# Altium schematic sheet numeric.SchDoc: Balise Vision - Interfaces numériques
size A3; Author: B Labbe; CompanyName: Oufffteam; DrawnBy: B Labbe; Engineer: B Labbe; Organization: Oufffteam; Address1: L3, 12a Rodborough Rd; Address2: Frenchs Forest; Address3: NSW; Address4: Australia 2086; Revision: A; SheetNumber: 2; SheetTotal: 10; DocumentName: Balise Vision - Interfaces numériques
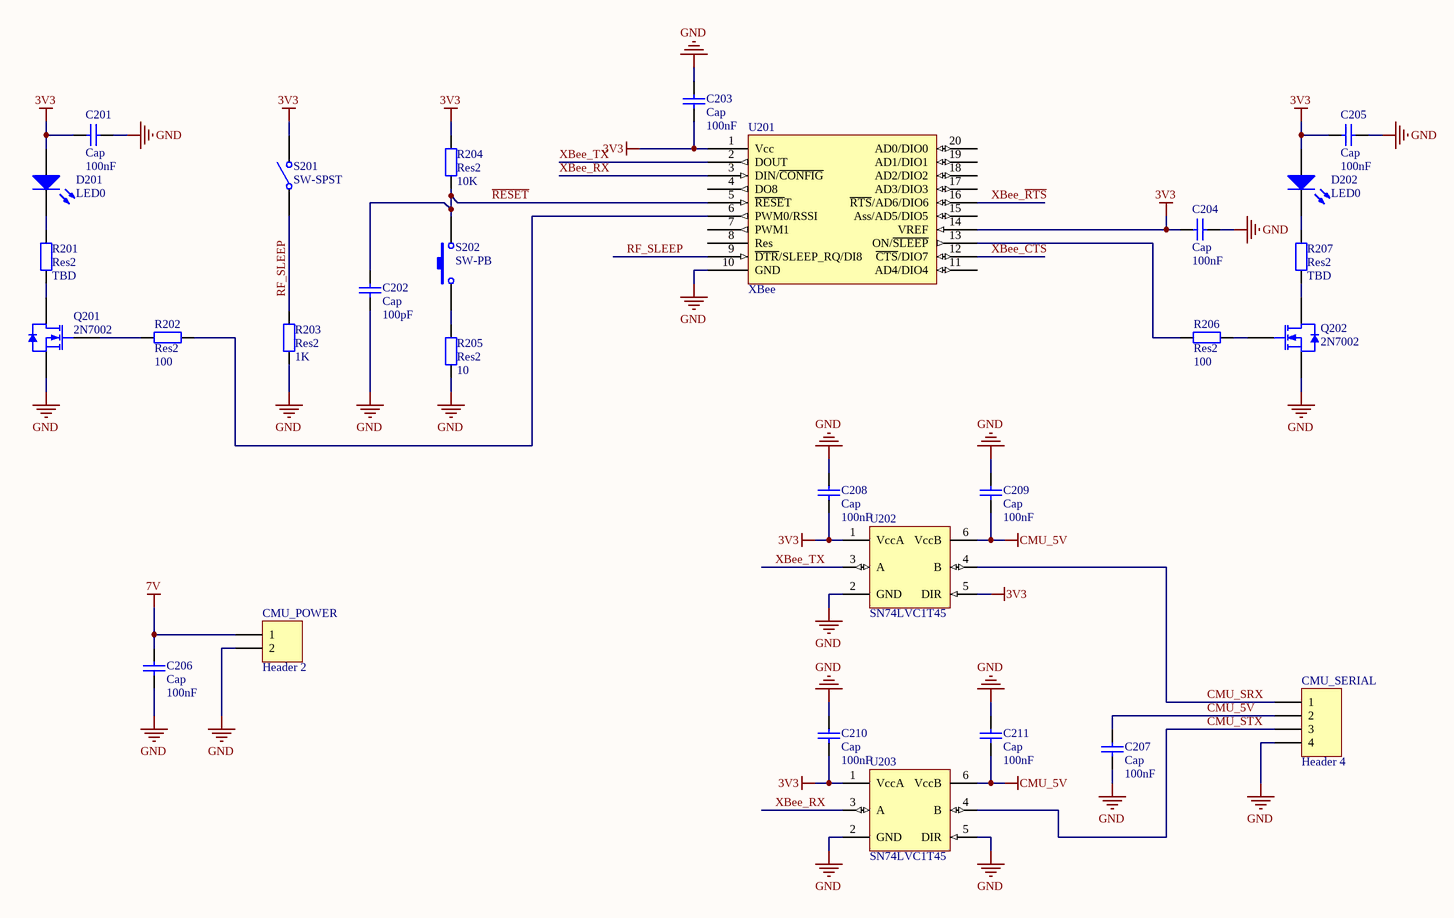
[diagram p0: numeric.SchDoc]

## Parts
C201  Cap  value 100nF  [RAD-0.3]
C202  Cap  value 100pF  [RAD-0.3]
C203  Cap  value 100nF  [RAD-0.3]
C204  Cap  value 100nF  [RAD-0.3]
C205  Cap  value 100nF  [RAD-0.3]
C206  Cap  value 100nF  [RAD-0.3]
C207  Cap  value 100nF  [RAD-0.3]
C208  Cap  value 100nF  [RAD-0.3]
C209  Cap  value 100nF  [RAD-0.3]
C210  Cap  value 100nF  [RAD-0.3]
C211  Cap  value 100nF  [RAD-0.3]
CMU_POWER  Header 2  [HDR1X2]
CMU_SERIAL  Header 4  [HDR1X4]
D201  LED0  [LED-0]
D202  LED0  [LED-0]
Q201  2N7002  [SOT23_N]
Q202  2N7002  [SOT23_N]
R201  Res2  value TBD  [AXIAL-0.4]
R202  Res2  value 100  [AXIAL-0.4]
R203  Res2  value 1K  [AXIAL-0.4]
R204  Res2  value 10K  [AXIAL-0.4]
R205  Res2  value 10  [AXIAL-0.4]
R206  Res2  value 100  [AXIAL-0.4]
R207  Res2  value TBD  [AXIAL-0.4]
S201  SW-SPST  [SPST-2]
S202  SW-PB  [SPST-2]
U201  XBee
U202  SN74LVC1T45  [1262-01]
U203  SN74LVC1T45  [1262-01]

## Nets
3V3: C201.1 C203.1 C204.2 C205.1 C208.1 C210.1 D201.1(A) D202.1(A) R204.2 S201.2(NO) U201.1(Vcc) U201.14(VREF) U202.1(VccA) U202.5(DIR) U203.1(VccA)
7V: C206.2 CMU_POWER.1
CMU_5V: C207.2 C209.1 C211.1 CMU_SERIAL.2 U202.6(VccB) U203.6(VccB)
GND: C201.2 C202.1 C203.2 C204.1 C205.2 C206.1 C207.1 C208.2 C209.2 C210.2 C211.2 CMU_POWER.2 CMU_SERIAL.4 Q201.2(S) Q202.2(S) R203.1 R205.1 U201.10(GND) U202.2(GND) U203.2(GND) U203.5(DIR)
CMU_SRX: CMU_SERIAL.1 U202.4(B)
CMU_STX: CMU_SERIAL.3 U203.4(B)
~{RESET}: C202.2 R204.1 S202.2 U201.5(~{RESE}T)
RF_SLEEP: R203.2 S201.1(COMMON) U201.9(~{DTR}/SLEEP_RQ/DI8)
XBee_~{CTS}: U201.12(~{CTS}/DIO7)
XBee_~{RTS}: U201.16(~{RTS}/AD6/DIO6)
XBee_RX: U201.3(DIN/~{CONFIG}) U203.3(A)
XBee_TX: U201.2(DOUT) U202.3(A)
NetD201_2: D201.2(K) R201.2
NetD202_2: D202.2(K) R207.2
NetQ201_1: Q201.1(G) R202.1
NetQ201_3: Q201.3(D) R201.1
NetQ202_1: Q202.1(G) R206.2
NetQ202_3: Q202.3(D) R207.1
NetR202_2: R202.2 U201.6(PWM0/RSSI)
NetR205_2: R205.2 S202.1
NetR206_1: R206.1 U201.13(ON/~{SLEEP})

Not connected (* = marked no-connect by the designer): U201 4(DO8) 7(PWM1) 8(Res) 11(AD4/DIO4) 15(Ass/AD5/DIO5) 17(AD3/DIO3) 18(AD2/DIO2) 19(AD1/DIO1) 20(AD0/DIO0)

## Notes on the sheet
- Title
- Size:
- Date:
- A3
- Number:
- Time:
- Revision:
- Sheet
- of
- Oufffteam
- 3 place Carnot
- 26100
- Romans sur Isère
- oufffteam@gmail.com
- File:

## Library data of the parts
C201-C211 = Cap: Capacitor; Published: 8-Jun-2000; LatestRevisionDate: 17-Jul-2002; LatestRevisionNote: Re-released for DXP Platform.; PackageReference: RAD-0.3; Publisher: Altium Limited
CMU_POWER = Header 2: Header, 2-Pin; LatestRevisionDate: 17-Jul-2002; LatestRevisionNote: Re-released for DXP Platform.; Publisher: Altium Limited
CMU_SERIAL = Header 4: Header, 4-Pin; LatestRevisionDate: 17-Jul-2002; LatestRevisionNote: Re-released for DXP Platform.; Publisher: Altium Limited
D201 D202 = LED0: Typical INFRARED GaAs LED; Published: 8-Jun-2000; LatestRevisionDate: 08-Jul-2005; LatestRevisionNote: Mech Layer 1 removed.; PackageReference: LED-0; Publisher: Altium Limited
Q201 Q202 = 2N7002: N-channel Enhancement Mode Field-effect Transistor; Published: 17-Sep-2003; LatestRevisionDate: 12-Dec-2006; LatestRevisionNote: IPC-7351 Footprint Added.; DatasheetVersion: 27-Jul-2000; PackageVersion: May-1999; PackageReference: SOT23; Publisher: Altium Limited; PackageDescription: 3-Pin SOT-23 Package 0.95 mm Pitch, 2.3 mm Lead Span; ComponentLink1Description: Manufacturer Link; ComponentLink1URL: http://www.semiconductors.philips.com/; ComponentLink2Description: Datasheet; ComponentLink2URL: http://www.semiconductors.philips.com/acrobat/datasheets/2N7002_4.pdf
R201-R207 = Res2: Resistor; Published: 8-Jun-2000; LatestRevisionDate: 17-Jul-2002; LatestRevisionNote: Re-released for DXP Platform.; PackageReference: AXIAL-0.4; Publisher: Altium Limited
S201 = SW-SPST: Single-Pole, Single-Throw Switch; Published: 24-Mar-1999; LatestRevisionDate: 17-Jul-2002; LatestRevisionNote: Re-released for DXP Platform.; PackageReference: SPST-2; Publisher: Altium Limited
S202 = SW-PB: Switch; Published: 24-Mar-1999; LatestRevisionDate: 17-Jul-2002; LatestRevisionNote: Re-released for DXP Platform.; PackageReference: SPST-2; Publisher: Altium Limited
U202 U203 = SN74LVC1T45: SINGLE-BIT DUAL-SUPPLY BUS TRANSCEIVER  WITH CONFIGURABLE VOLTAGE TRANSLATION AND 3-STATE OUTPUTS